# EasyEDA Pro project ProPrj_NavBot-EN01_2025-11-07.epro, board MAIN
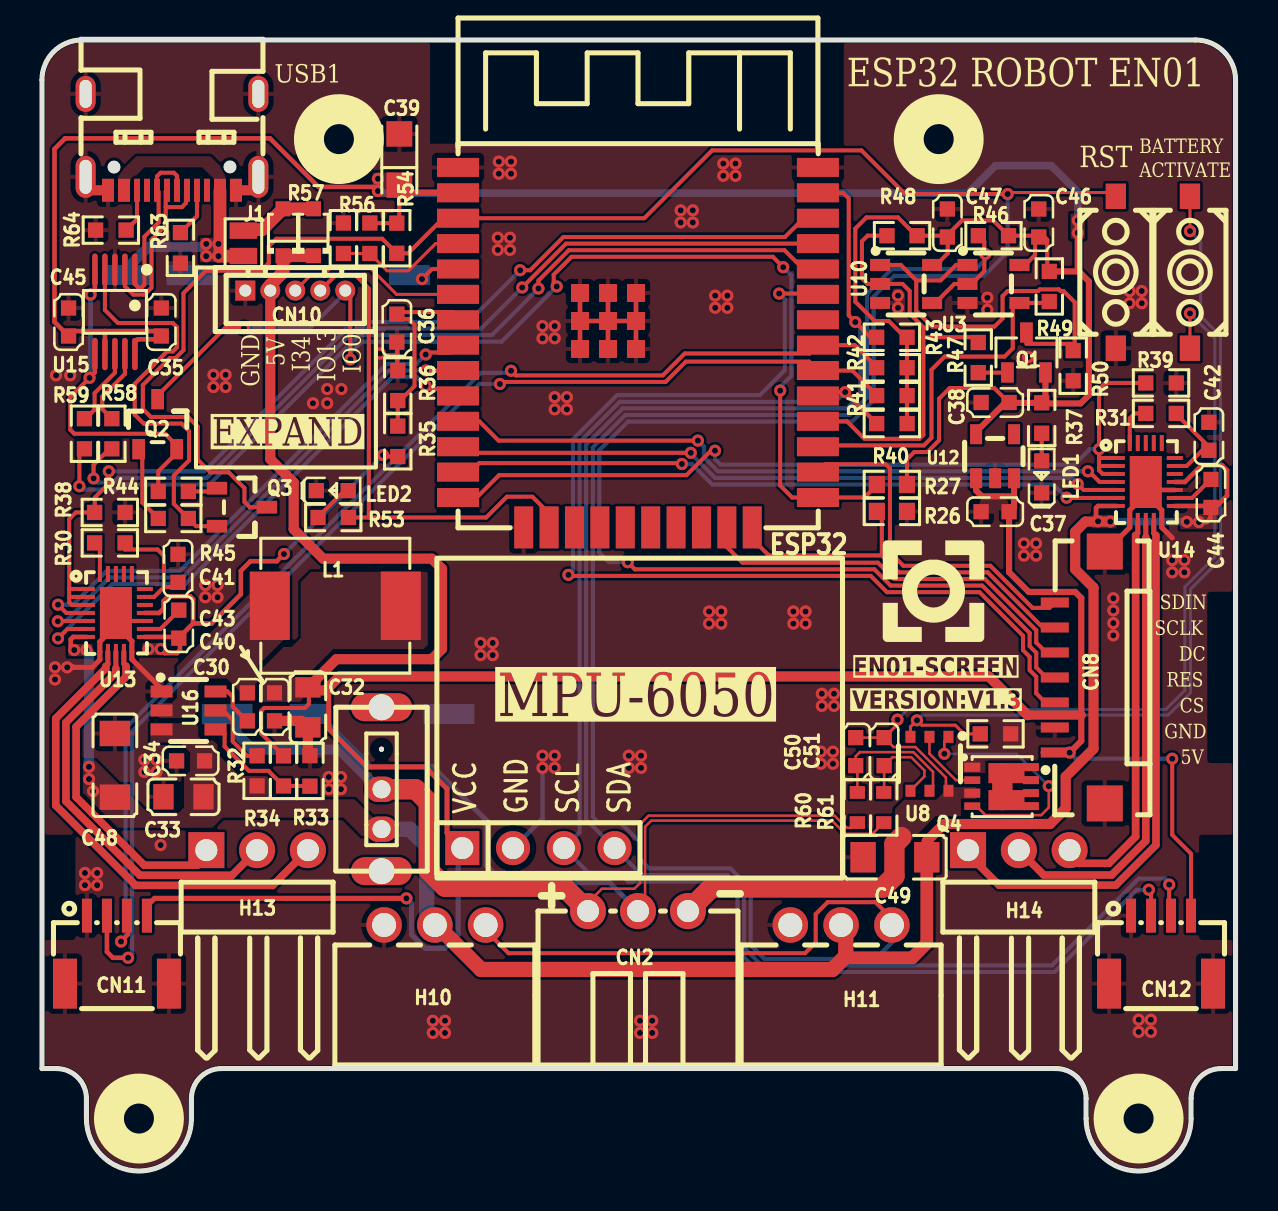
[diagram p14: board, top side]
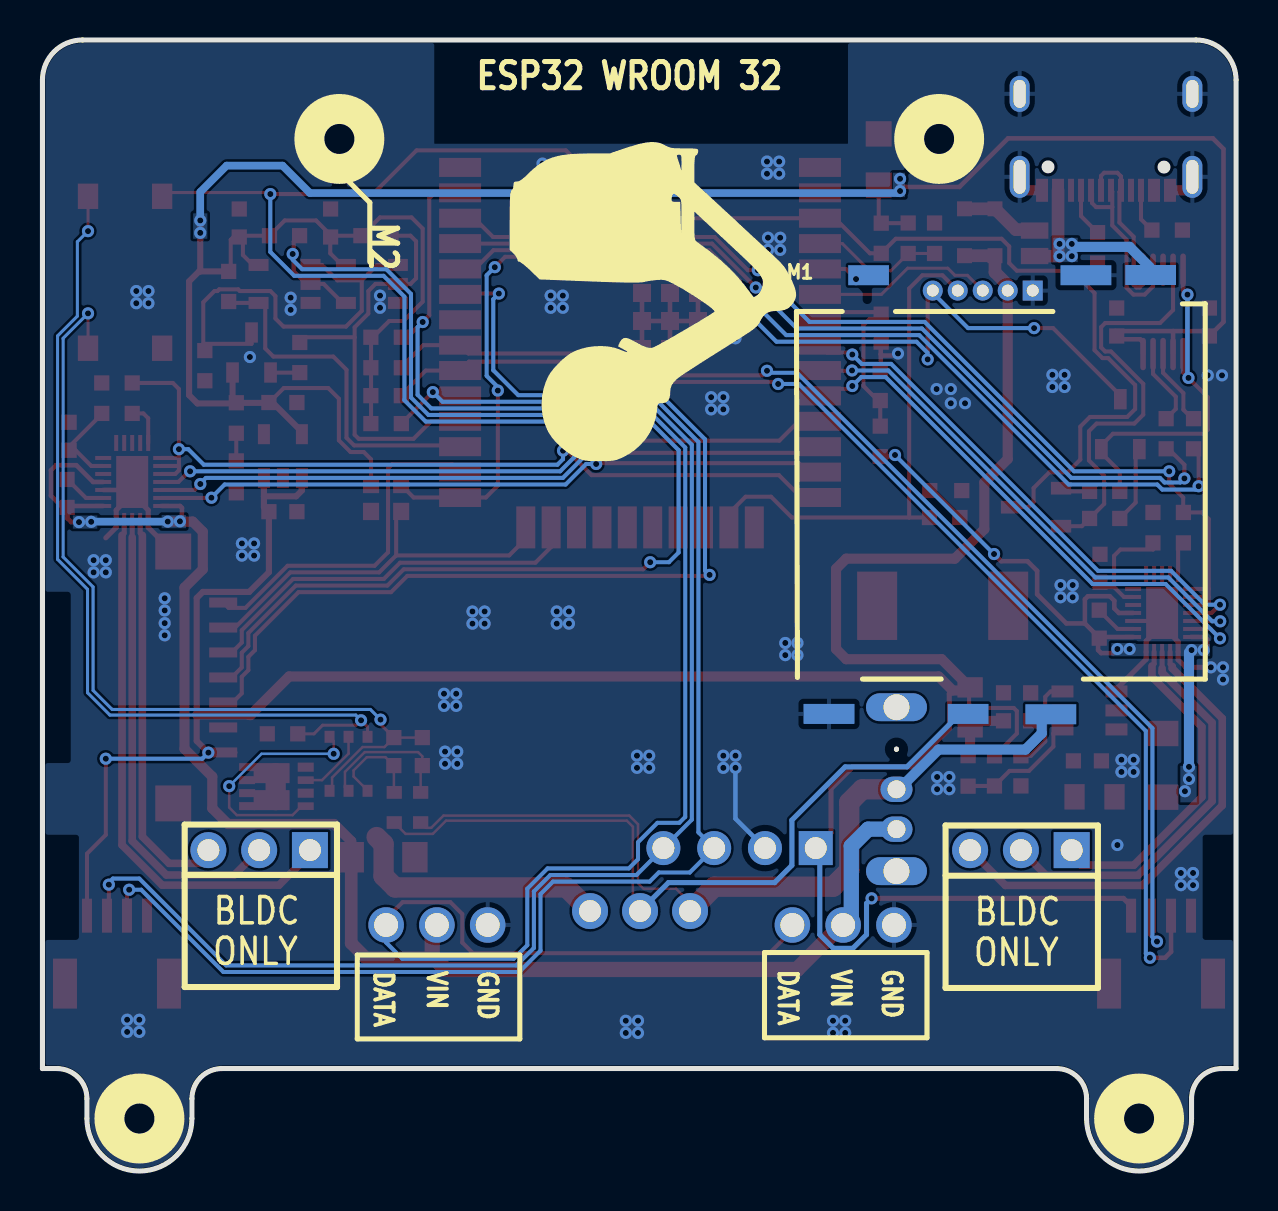
[diagram p15: board, bottom side, seen from below]

Outline 59.7 x 56.57 mm; copper layers: Top Layer, Bottom Layer. Coordinates in mm from the lower left corner of the outline.
Outline path: 0,54.57 0,5.12 0.72,5.12 arc(1.79,4.69) 2.22,3.62 2.22,2.62 arc(4.85,0) 7.47,2.62 7.47,3.62 arc(7.91,4.69) 8.97,5.12 50.72,5.12 arc(51.79,4.69) 52.22,3.62 52.22,2.62 arc(54.85,0) 57.47,2.62 57.47,3.62 arc(57.91,4.69) 58.97,5.12 59.7,5.12 59.7,54.57 arc(59.11,55.99) 57.7,56.57 2,56.57 arc(0.59,55.99) 0,54.57
Stack: Top Layer 0.035mm / Dielectric1 1.51mm FR4 er 4.5 / Bottom Layer 0.035mm

## Design rules (mm)
template: 用户自定义配置
spacing Default (default): track to track 0.127, other pairs 0 to 0.152
track width Default (default): min 0.127, default 0.254, max 25.4
differential pair differentialPair (default): width min 0.127, default 0.254, max 2.54; gap min 0.152, default 0.152
via Default (default): diameter min 0.45, default 0.61, max 100.025; hole min 0.249, default 0.305, max 59.995

## Placement (name value [footprint] x y rotation side)
C30  100nF  [C0603]  10.25 23.22 270 top
C32  22uF  [C0805]  13.3 23.19 90 top
C33  22uF  [C0805]  7.08 18.72 0 top
C34  100nF  [C0603]  7.43 20.5 0 top
C35  1uF  [C0603]  5.99 42.47 90 top
C36  100nF  [C0603]  17.77 42.16 90 top
C37  10uF  [C0603]  47.67 32.96 0 top
C38  10uF  [C0603]  47.67 38.42 0 top
C39  10uF  [CAP-SMD_L3.2-W1.6-RD-C7171]  17.87 50.59 90 top
C40  100nF  [C0603]  11.65 23.22 90 top
C41  4.7uF  [C0603]  6.82 30.15 90 top
C42  4.7uF  [C0603]  58.39 36.75 90 top
C43  1uF  [C0603]  6.82 27.35 270 top
C44  1uF  [C0603]  58.45 33.89 270 top
C45  100nF  [C0603]  1.31 42.47 270 top
C46  100nF  [C0603]  49.88 47.42 90 top
C47  100nF  [C0603]  45.31 47.42 90 top
C48  100uF  [C1206]  3.65 20.29 270 top
C49  100uF  [C1206]  42.66 15.7 0 top
C50  100nF  [C0603]  40.68 20.98 270 top
C51  100nF  [C0603]  42.1 20.98 270 top
CN2  HX25003-3WAP  [CONN-TH_3P-P2.50_HX25003-3WAP]  29.81 13 0 top
CN7  SS-12D02-VG4  [SW-TH_SS-12D02-VG4]  16.98 19.1 90 top
CN8  1.25-7P WT  [CONN-SMD_7P-P1.25-L4.4-W13.5]  51.86 24.69 90 top
CN10  HC-1.25-5A  [CONN-TH_5P-P1.25_HCTL_HC-1.25-5A]  12.67 44.04 0 top
CN11  WAFER-SH1.0-4PWB  [CONN-SMD_4P-P1.00_WAFER-SH1.0-4PWB]  3.75 11.07 0 top
CN12  WAFER-SH1.0-4PWB  [CONN-SMD_4P-P1.00_WAFER-SH1.0-4PWB]  55.97 11.07 0 top
D2  1N5819WS  [SOD-323_L1.8-W1.3-LS2.5-RD]  13.58 46.96 90 top
D3  1N5819WS  [SOD-323_L1.8-W1.3-LS2.5-RD]  12.06 46.96 90 top
H10  5264-3A  [CONN-TH_5264-3AW]  19.65 11.61 0 top
H11  5264-3A  [CONN-TH_5264-3AW]  39.97 11.61 0 top
H13  PZ254R-11-03P  [HDR-TH_3P-P2.54-H-M-W10.4]  10.76 16.05 0 top
H14  PZ254R-11-03P  [HDR-TH_3P-P2.54-H-M-W10.4]  48.86 16.05 0 top
H15  -  [HDR-TH_4P-P2.54-V-M]  24.83 16.15 0 top
J1  -  [0805短接点_FG]  10.07 46.4 90 top
KEY2  K2-3.6×6.1_SMD  [KEY-SMD_2P-L6.2-W3.6-LS8.0]  53.71 44.96 270 top
KEY3  K2-3.6×6.1_SMD  [KEY-SMD_2P-L6.2-W3.6-LS8.0]  57.42 44.96 270 top
L1  10uH  [IND-SMD_L7.3-W6.6]  14.67 28.27 180 top
LED1  KT-0603R  [LED0603-RD]  50 34.72 90 top
LED2  NCD0603B1  [LED0603-RD]  14.52 34.03 0 top
M1  -  [2S充电模块]  11.78 33.83 180 bottom
Q1  SS8550-C148468  [SOT-23-3_L2.9-W1.3-P1.90-LS2.4-BR#2]  49.24 40.94 270 top
Q2  SS8050_C541705  [SOT-23-3_L2.9-W1.3-P1.90-LS2.4-BR]  5.79 37.36 270 top
Q3  SS8050_C541705  [SOT-23-3_L2.9-W1.3-P1.90-LS2.4-BR]  10 33.2 180 top
Q4  WSD3056DN33  [POWERPAK-SO-8_L3.0-W3.0-P0.65-BL]  48 19.23 270 top
R26  4.7K  [R0603]  42.51 32.99 0 top
R27  4.7K  [R0603]  42.51 34.34 0 top
R30  4.7kΩ  [R0603#2]  3.39 31.42 180 top
R31  4.7kΩ  [R0603#2]  55.97 37.89 180 top
R32  10kΩ  [R0603#2]  10.76 20.02 90 top
R33  18kΩ  [R0603#2]  13.4 20.01 270 top
R34  100kΩ  [R0603#2]  12.08 20.01 90 top
R35  3kΩ  [R0603#2]  17.8 36.5 270 top
R36  1kΩ  [R0603#2]  17.8 39.29 270 top
R37  3.3kΩ  [R0603#2]  50 37.67 270 top
R38  4.7kΩ  [R0603#2]  3.39 32.94 0 top
R39  4.7kΩ  [R0603#2]  55.97 39.42 0 top
R40  4.7kΩ  [R0603#2]  42.51 37.39 0 top
R41  4.7kΩ  [R0603#2]  42.51 38.78 0 top
R42  4.7kΩ  [R0603#2]  42.51 40.18 0 top
R43  4.7kΩ  [R0603#2]  42.51 41.7 0 top
R44  10kΩ  [R0603#2]  6.57 33.99 0 top
R45  10kΩ  [R0603#2]  6.57 32.64 180 top
R46  10kΩ  [R0603#2]  47.59 46.78 0 top
R47  10kΩ  [R0603#2]  46.83 40.69 270 top
R48  10kΩ  [R0603#2]  43.02 46.78 0 top
R49  10kΩ  [R0603#2]  50.38 44.24 90 top
R50  10kΩ  [R0603#2]  51.58 40.28 90 top
R53  3.3kΩ  [R0603#2]  14.57 32.69 180 top
R54  10kΩ  [R0603#2]  17.75 46.66 270 top
R56  30kΩ  [R0603#2]  16.4 46.66 90 top
R57  2kΩ  [R0603#2]  15.08 46.66 270 top
R58  1kΩ  [R0603#2]  3.5 36.88 270 top
R59  1kΩ  [R0603#2]  2.12 36.88 270 top
R60  330Ω  [R0603#3]  40.78 18.18 90 top
R61  330Ω  [R0603#3]  42.1 18.18 90 top
R62  2kΩ  [R0603#2]  47.69 21.87 180 top
R63  4.7kΩ  [R0603#2]  6.93 46.18 90 top
R64  4.7kΩ  [R0603#2]  3.45 47.06 0 top
U3  SN74LVC1G125DBVR  [SOT-23-5_L3.0-W1.7-P0.95-LS2.8-BR]  47.59 44.37 180 top
U5  ESP32-WROOM-32E-N8  [WIFI-SMD_ESP32-WROOM-32E]  29.81 41.2 270 top
U8  HY2120-LB  [SOT-23-6_L2.9-W1.6-P0.95-LS2.8-BR]  44.39 20.37 90 top
U10  SN74LVC1G126DBVR  [SOT-23-5_L3.0-W1.7-P0.95-LS2.8-BR]  43.22 44.37 180 top
U12  XC6210B332MR  [SOT-23-5_L2.9-W1.6-P0.95-LS2.8-BR]  47.67 35.75 270 top
U13  SS6343M  [QFN-24_L4.0-W3.0-P0.40-TL-EP]  3.7 27.91 0 top
U14  SS6343M  [QFN-24_L4.0-W3.0-P0.40-TL-EP]  55.21 34.47 0 top
U15  CH340X  [MSOP-10_L3.0-W3.0-P0.50-LS5.0-BL]  3.65 42.97 180 top
U16  TPS563201DDCR  [SOT-23-6_L2.9-W1.6-P0.95-LS2.8-BR#2]  7.33 23.04 180 top
USB1  TYPEC-304-ACP16  [USB-C-SMD_TYPE-C-16P-1]  6.5 51.47 180 top

## Footprints (pads in the part's own frame, mm; a bottom-side part is the same pattern mirrored in y, then rotated)
2S充电模块
  rect 2.54x1 smd: 1(7.505,10.988) 2(4.271,10.978) 4(-8.582,-10.967) 6(2.514,-10.984)
  rect 2.032x1 smd: 3(-6.601,10.978) 5(-1.623,-10.967)
0805短接点_FG
  rect 0.813x1.377 smd: 1(-0.635,0) 2(0.635,0)
C0603
  rect 0.762x0.762 smd: 1(-0.7,0.019) 2(0.7,0.019)
C0805
  rect 1.016x1.27 smd: 1(-1,0) 2(1,0)
C1206
  rect 1.27x1.524 smd: 1(-1.593,0) 2(1.593,0)
CAP-SMD_L3.2-W1.6-RD-C7171
  rect 1.27x1.296 smd: 1(-1.28,0) 2(1.28,0)
CONN-SMD_4P-P1.00_WAFER-SH1.0-4PWB
  rect 0.5x1.7 smd: 1(-1.5,1.7) 2(-0.5,1.7) 3(0.5,1.7) 4(1.5,1.7)
  rect 1.2x2.5 smd: 5(-2.6,-1.7) 6(2.6,-1.7)
CONN-SMD_7P-P1.25-L4.4-W13.5
  rect 1.8x1.8 smd: 0(-6.3,-1.3) 0(6.3,-1.3)
  rect 0.5x1.4 smd: 1(-3.75,1.198) 2(-2.5,1.198) 3(-1.25,1.198) 4(0,1.198) 5(1.25,1.198) 6(2.499,1.198) 7(3.75,1.198)
CONN-TH_3P-P2.50_HX25003-3WAP
  round 1.8 hole 1.1: 1(-2.5,0) 2(0.001,0) 3(2.5,0)
CONN-TH_5P-P1.25_HCTL_HC-1.25-5A
  rect 1x1 hole 0.6: 1(-2.5,0)
  round 1 hole 0.6: 2(-1.25,0) 3(0,0) 4(1.25,0) 5(2.5,0)
CONN-TH_5264-3AW
  round 1.778 hole 1.2: 1(2.54,0.7) 2(0,0.7) 3(-2.54,0.7)
HDR-TH_3P-P2.54-H-M-W10.4
  rect 1.8x1.8 hole 1.1: 1(-2.54,0)
  round 1.8 hole 1.1: 2(0,0) 3(2.54,0)
HDR-TH_4P-P2.54-V-M
  rect 1.7x1.7 hole 1.1: 1(-3.81,0)
  round 1.7 hole 1.1: 2(-1.27,0) 3(1.27,0) 4(3.81,0)
IND-SMD_L7.3-W6.6
  rect 2x3.42 smd: 1(3.278,0) 2(-3.278,0)
KEY-SMD_2P-L6.2-W3.6-LS8.0
  rect 1.27x1.016 smd: 1(-3.8,0) 2(3.8,0)
LED0603-RD
  rect 0.762x0.762 smd: 1(-0.799,0) 2(0.799,0)
MSOP-10_L3.0-W3.0-P0.50-LS5.0-BL
  oval 0.28x1.62 smd: 1(-1,-2.11) 2(-0.5,-2.11) 3(0,-2.11) 4(0.5,-2.11) 5(1,-2.11) 6(1,2.11) 7(0.5,2.11) 8(0,2.11) 9(-0.5,2.11) 10(-1,2.11)
POWERPAK-SO-8_L3.0-W3.0-P0.65-BL
  rect 0.457x0.8 smd: 1(-0.975,-1.466) 3(0.325,-1.466)
  rect 0.381x0.8 smd: 2(-0.325,-1.466) 4(0.975,-1.466)
  rect 0.4x0.8 smd: 5(0.975,1.466) 6(0.325,1.466) 7(-0.325,1.466) 8(-0.975,1.466)
  rect 1x1.8 smd: 9(-0.675,0.241) 10(0.675,0.241)
QFN-24_L4.0-W3.0-P0.40-TL-EP
  rect 0.8x0.2 smd: 1(-1.45,1.2) 2(-1.45,0.8) 3(-1.45,0.4) 4(-1.45,0) 5(-1.45,-0.4) 6(-1.45,-0.8) 7(-1.45,-1.2) 13(1.45,-1.2) 14(1.45,-0.8) 15(1.45,-0.4) 16(1.45,-0.001) 17(1.45,0.4) 18(1.45,0.8) 19(1.45,1.2)
  rect 0.2x0.8 smd: 8(-0.8,-1.95) 9(-0.4,-1.95) 10(0,-1.95) 11(0.4,-1.95) 12(0.8,-1.95) 20(0.8,1.95) 21(0.4,1.95) 22(0,1.95) 23(-0.4,1.95) 24(-0.8,1.95)
  rect 1.6x2.6 smd: 25(0,0)
R0603
  rect 0.806x0.864 smd: 1(-0.753,0) 2(0.753,0)
R0603#2
  rect 0.762x0.762 smd: 1(-0.762,0) 2(0.762,0)
R0603#3
  rect 0.635x0.762 smd: 1(-0.753,0) 2(0.753,0)
SOD-323_L1.8-W1.3-LS2.5-RD
  rect 0.75x0.75 smd: 1(-1.173,0) 2(1.173,0)
SOT-23-3_L2.9-W1.3-P1.90-LS2.4-BR
  rect 1.016x0.635 smd: 1(1.25,-0.95) 2(1.25,0.95) 3(-1.25,0)
SOT-23-3_L2.9-W1.3-P1.90-LS2.4-BR#2
  rect 1.016x0.635 smd: 1(1,-0.95) 2(1,0.95) 3(-1,0)
SOT-23-5_L2.9-W1.6-P0.95-LS2.8-BR
  rect 1x0.6 smd: 1(1.1,-0.95) 2(1.1,0) 3(1.1,0.95) 4(-1.1,0.95) 5(-1.1,-0.95)
SOT-23-5_L3.0-W1.7-P0.95-LS2.8-BR
  rect 1x0.6 smd: 1(1.3,-0.95) 2(1.3,0) 3(1.3,0.95) 4(-1.3,0.95) 5(-1.3,-0.95)
SOT-23-6_L2.9-W1.6-P0.95-LS2.8-BR
  rect 0.6x0.5 smd: 1(1.35,-0.95) 2(1.35,0) 3(1.35,0.95) 4(-1.35,0.95) 5(-1.35,0) 6(-1.35,-0.95)
SOT-23-6_L2.9-W1.6-P0.95-LS2.8-BR#2
  rect 1.1x0.6 smd: 1(1.35,-0.95) 2(1.35,0) 3(1.35,0.95) 4(-1.35,0.95) 5(-1.35,0) 6(-1.35,-0.95)
SW-TH_SS-12D02-VG4
  oval 1.27x1.6 hole 0.9: 1(-2,0) 2(-0.006,0)
  oval 0.254x0.254 hole 0.9: 3(2,0)
  oval 1.397x3.048 hole 1.3: 4(4.1,0) 5(-4.1,0)
USB-C-SMD_TYPE-C-16P-1
  rect 0.6x1.15 smd: A1B12(-3.2,2.41) A4B9(-2.4,2.41) B1A12(3.2,2.41) B4A9(2.4,2.41)
  rect 0.3x1.15 smd: A5(-1.25,2.41) A6(-0.25,2.41) A7(0.25,2.41) A8(1.25,2.41) B5(1.75,2.41) B6(0.75,2.41) B7(-0.75,2.41) B8(-1.75,2.41)
  oval 1x2.1 hole 0.6x1.7: EP(-4.32,1.74) EP(4.32,1.74)
  oval 1x1.8 hole 0.6x1.4: EP(-4.32,-2.41) EP(4.32,-2.41)
WIFI-SMD_ESP32-WROOM-32E
  rect 0.95x2.1 smd: 1(-9.002,-9) 2(-7.732,-9) 3(-6.463,-9) 4(-5.192,-9) 5(-3.922,-9) 6(-2.652,-9) 7(-1.383,-9) 8(-0.113,-9) 9(1.157,-9) 10(2.428,-9) 11(3.697,-9) 12(4.968,-9) 13(6.237,-9) 14(7.508,-9) 25(7.508,9) 26(6.237,9) 27(4.968,9) 28(3.697,9) 29(2.428,9) 30(1.157,9) 31(-0.113,9) 32(-1.383,9) 33(-2.652,9) 34(-3.922,9) 35(-5.192,9) 36(-6.463,9) 37(-7.732,9) 38(-9.002,9)
  rect 2.1x0.95 smd: 15(9.002,-5.715) 16(9.002,-4.445) 17(9.002,-3.175) 18(9.002,-1.905) 19(9.002,-0.635) 20(9.002,0.635) 21(9.002,1.905) 22(9.002,3.175) 23(9.002,4.445) 24(9.002,5.715)
  rect 0.9x0.9 smd: 39(-2.721,-0.1) 39(-2.721,-1.5) 39(-2.721,-2.9) 39(-1.321,-0.1) 39(-1.321,-1.5) 39(-1.321,-2.9) 39(0.079,-0.1) 39(0.079,-1.5) 39(0.079,-2.9)

## Nets
As in the schematic.

Pads without a net: CN7 3 4 5; U5 17 18 19 20 21 22 32; U12 4; U13 17 19 20 21 22 23; U14 17 19 20 21 22 23; USB1 A8 B8

## Via types
v1: diameter 0.61, hole 0.305, Top Layer to Bottom Layer, 191 vias

## Routing (per net, layer and track width the routed paths; a pad name or vN(x,y) marks a point on that pad's centre or on a via; arc(x,y) is an arc through that point)
GND: length 43.8
  Top Layer w0.203: 3.7,27.28 U13.25 4.1,27.51 U13.15
  Top Layer w0.229: U5.39 U5.39 ; U5.39 U5.39 ; U5.39 U5.39 ; U5.39 U5.39 ; U5.39 U5.39 ; U5.39 U5.39 ; U5.39 U5.39 ; U5.39 U5.39 ; U14.15 55.61,34.07 U14.25 ; R36.1 17.77,40.07 17.77,40.85 ; v1(16.91,40.89) 17.01,40.79 17.71,40.79 17.77,40.85 ; 17.77,41.46 17.77,40.85
  Top Layer w0.254: U16.1 5.98,24.11 4.5,25.6 U13.12 4.5,26.5 3.72,27.28 3.7,27.28 3.7,27.28 2.9,26.48 U13.8 2.9,25.58 2.51,25.19 1.57,25.19 1.52,25.25 ; 56.53,31.67 56.01,32.19 U14.12 56.01,33.06 55.24,33.83 55.21,33.83 ; U14.25 55.21,33.86 54.41,33.06 U14.8 54.41,32.19 53.21,30.99 52.7,30.99
  Top Layer w0.508: 11.65,22.52 12.98,22.52 C32.1 13.3,20.87 13.4,20.77 ; USB1.EP 2.18,49.06 USB1.B1A12 ; USB1.A1B12 10.82,49.06 USB1.EP
  Bottom Layer w0.229: 23.88,16.47 25.04,17.63 v1(25.04,20.17)
  vias: v1(0.7,39.8) v1(0.65,25.19) v1(0.65,24.59) v1(1.26,25.19) v1(1.41,39.8) v1(2.15,14.91) v1(2.15,14.3) v1(2.76,14.91) v1(2.76,14.3) v1(5.12,20.57) v1(5.12,19.96) v1(5.73,20.57) v1(5.73,19.96) v1(5.94,16.3) v1(8.17,29.31) v1(8.17,28.7) v1(8.58,39.83) v1(8.58,39.22) v1(8.78,29.31) v1(8.78,28.7) v1(9.19,39.83) v1(9.19,39.22) v1(13.56,38.4) v1(14.27,39.11) v1(14.27,38.4) v1(14.34,19.71) v1(14.34,19.1) v1(14.98,39.11) v1(14.95,19.71) v1(14.95,19.1) v1(19.55,7.52) v1(19.55,6.91) v1(20.16,7.52) v1(20.16,6.91) v1(21.94,26.41) v1(21.94,25.8) v1(22.55,26.41) v1(22.55,25.8) v1(22.8,46.68) v1(22.8,46.07) v1(22.85,50.49) v1(22.85,49.88) v1(23.41,46.68) v1(23.41,46.07) v1(23.46,50.49) v1(23.46,49.88) v1(25.04,42.26) v1(25.04,41.65) v1(25.04,20.78) v1(25.65,42.26) v1(25.65,41.65) v1(25.65,38.71) v1(25.65,38.1) v1(25.65,20.78) v1(25.65,20.17) v1(26.25,38.71) v1(26.25,38.1) v1(29.35,20.78) v1(29.35,20.17) v1(29.91,7.52) v1(29.91,6.91) v1(29.96,20.78) v1(29.96,20.17) v1(30.52,7.52) v1(30.52,6.91) v1(31.94,48.05) v1(31.94,47.45) v1(32.55,48.05) v1(32.55,47.45) v1(33.37,27.99) v1(33.37,27.38) v1(33.67,43.79) v1(33.67,43.18) v1(33.98,27.99) v1(33.98,27.38) v1(34.08,50.39) v1(34.08,49.78) v1(34.28,43.79) v1(34.28,43.18) v1(34.69,50.39) v1(34.69,49.78) v1(37.58,27.99) v1(37.58,27.38) v1(38.19,27.99) v1(38.19,27.38) v1(39.01,23.87) v1(39.01,23.26) v1(38.95,20.98) v1(38.95,20.37) v1(39.62,23.87) v1(39.62,23.26) v1(39.56,20.98) v1(39.56,20.37) v1(42.82,43.79) v1(42.82,43.18) v1(47.29,43.69) v1(47.29,43.08) v1(49.12,31.39) v1(49.12,30.78) v1(49.32,40.72) v1(49.72,31.39) v1(49.72,30.78) v1(53.59,28.65) v1(53.59,28.04) v1(53.59,27.41) v1(53.59,26.8) v1(54.4,44.02) v1(54.4,43.41) v1(54.86,7.57) v1(54.86,6.96) v1(55.01,44.02) v1(55.01,43.41) v1(55.47,7.57) v1(55.47,6.96) v1(56.53,30.55) v1(56.53,29.94) v1(57.14,30.55) v1(57.14,29.94)
VBUS: length 9
  Top Layer w0.635: 10.07,45.82 10.02,45.76 v1(8.83,45.76) 8.9,45.84 USB1.A4B9
  Bottom Layer w0.508: 4.32,45.22 5.33,46.23 8.07,46.23 v1(8.22,46.37)
  vias: v1(8.22,45.76) v1(8.83,46.37)
VCC-3.3V: length 135.5
  Top Layer w0.203: 45.31,46.72 45.31,45.9 44.72,45.32 U10.5 ; 45.31,46.72 45.24,46.78 R48.2 43.73,46.78 42.82,47.7 41.24,47.7 40.68,47.14 40.68,43.48 41.65,42.52 42.36,42.52 43.17,41.7 43.26,41.7 43.26,37.39 ; 45.31,46.72 45.31,46.84 46.02,47.55 47.58,47.55 R46.2 49.81,46.78 49.88,46.72 ; U3.5 49.18,45.32 49.67,45.82 49.67,46.52 49.88,46.72 ; R49.2 50.28,45.1 50.28,46.58 50.15,46.72 49.88,46.72 ; 16.22,47.41 R54.1 17.87,47.54 C39.1 ; R27.2 43.26,35.6 43.63,35.96 44.29,35.96 44.87,36.55 44.87,38.63 45.41,39.16 47.63,39.16 48.37,38.42
  Top Layer w0.229: 3.14,42.01 3.15,42 U15.7 ; 3.14,42.01 6.06,42.01 6.06,41.77 5.9,41.6 4.8,41.6 4.65,41.46 U15.10 ; 3.14,42.01 1.33,42.01 C45.2 0.63,42.47 0.63,51.12 1.16,51.65 11.41,51.65 13.83,49.22 16.59,49.22 16.76,49.05
  Top Layer w0.305: U12.5 46.72,36.98 48.17,38.42 49.98,38.42 50,38.39 ; R49.2 51.81,45 ; 51.81,45 51.87,45 52.37,44.5 52.37,38.81 51.95,38.39 50,38.39 ; 51.81,45 v1(51.81,46.93) v1(51.81,47.55) ; Q1.2 50.19,38.58 50,38.39 ; U5.2 18.26,48.93 C39.1
  Bottom Layer w0.381: v1(51.81,47.55) 51.81,48.97 50.49,50.29 47.69,50.29 46.32,48.92 16.91,48.92 v1(16.81,49.02)
  vias: v1(16.81,49.63)
VCC-5V: length 151.1
  Top Layer w0.203: v1(56.53,20.62) 56.53,16.81 57.47,15.87 CN12.4 ; 13.35,24.14 13.35,23.37 13.15,23.16 11.12,23.16 10.96,23.01 10.96,21.88 R34.2
  Top Layer w0.254: v1(18.23,13.64) 5.63,13.64 5.25,13.26 CN11.4 ; 14.17,24.04 14.34,23.87 14.34,22.12 16.25,20.22 19.17,20.22 20.26,19.12 20.26,16.91 H15.1
  Top Layer w0.305: U12.3 48.62,33.75 ; 48.62,33.75 47.01,33.75 46.72,34.04 U12.1 ; 48.62,33.75 48.62,33.21 48.37,32.96 48.37,29.95 49.36,28.97 51.68,28.97 51.98,28.66 51.98,21.51 v1(51.4,20.93) 50.11,20.93 50.1,20.94
  Top Layer w0.457: 49.34,22.81 51.98,22.81
  Top Layer w0.508: 49.34,22.81 49.29,22.81 47.36,24.74 14.88,24.74 14.17,24.04 13.46,24.04 13.35,24.14 ; C32.2 13.31,24.19 14.72,25.6 19.5,25.6 20.01,26.11 20.01,30.12 19.5,30.63 14.06,30.63 12.59,32.1 12.59,34.44 11.42,35.61 CN10.2
  Top Layer w0.635: D2.1 D3.1 12.06,44.96 11.42,44.32 11.42,44.04
  Bottom Layer w0.203: v1(56.53,20.62) 51.71,20.62 v1(51.4,20.93)
  Bottom Layer w0.254: v1(18.23,13.64) 18.48,13.38 18.48,11.82 19.17,11.14 20.13,11.14 20.82,11.82 20.82,15.95 H15.1
VIN: length 109.2
  Top Layer w0.229: 7.56,27.39 8.49,27.39 9.95,28.85 9.95,30.02 10.43,30.5 11.75,30.5 v1(12.1,30.86) ; 7.56,27.39 6.82,26.65 ; 7.56,27.39 7.56,28.6 7.41,28.75 6.32,28.75 6.09,28.52 6.09,28.14 5.86,27.91 U13.16 ; v1(1.62,26.06) 1.44,26.24 1.44,26.59 1.56,26.71 U13.7 ; 6.82,26.65 6.9,26.58 6.9,26.06 6.75,25.91 6.14,25.91 v1(5.94,26.11) ; 6.82,26.65 6.76,26.71 U13.13 ; 17.8,35.74 17.13,35.74 v1(17.06,35.81) ; 58.45,33.19 58.69,33.19 59.28,33.78 59.28,35.05 59.02,35.3 58,35.3 57.17,34.47 U14.16 ; 58.45,33.19 58.38,33.27 U14.13 ; 58.45,33.19 58.45,32.65 58.26,32.46 v1(57.87,32.46) 57.86,32.47 v1(57.26,32.47) ; U14.7 52.82,33.27 52.72,33.17 52.72,32.6 v1(52.82,32.5)
  Top Layer w0.508: C49.2 44.26,16.5 45.11,17.36 50.42,17.36 51.2,18.14 51.2,19.73 52.59,21.12 52.59,29.18 51.68,30.1 51.68,31.98 52.19,32.48 v1(53.43,32.48)
  Top Layer w0.635: 40.21,10.67 43.53,10.67 44.26,11.39 C49.2
  Top Layer w0.762: H11.2 40.21,12.07 40.21,10.75 39.54,10.08 21.96,10.08 19.89,12.15 19.8,12.15 H10.2
  Bottom Layer w0.203: v1(17.06,35.81) 17.06,35.81 12.11,30.86 v1(12.1,30.86)
  Bottom Layer w0.381: 57.29,32.46 57.27,32.48 v1(53.43,32.48)
  Bottom Layer w0.508: v1(2.35,20.22) 2.35,25.93 v1(2.23,26.06)
  Bottom Layer w0.762: H10.2 19.24,12.71 19.24,16.25 18.4,17.1 CN7.1
  vias: v1(2.35,19.61) v1(2.56,19) v1(5.33,26.11)
B1: length 38.3
  Top Layer w0.127: R61.1 41.54,16.86 40.17,16.86 39.51,17.52 30.47,17.52 30.17,17.22 30.17,13.36 CN2.2
  Bottom Layer w0.254: 13.86,22.86 13.86,22.82 16.46,20.22 19.55,20.22 22.22,17.55 22.22,15.29 23.08,14.43 28.39,14.43 CN2.2
B2: length 42
  Top Layer w0.127: CN2.1 27.31,13.42 28.01,14.12 29.63,14.12 29.91,14.4 29.91,17.35 30.34,17.78 39.64,17.78 40.25,17.17 40.52,17.17 R60.1
  Top Layer w1.016: CN2.1 26.09,14.22 20.16,14.22 19.35,15.03 19.35,18.44 18.69,19.09 CN7.2
  Bottom Layer w0.508: CN7.2 16.86,19.09 14.88,21.08 10.53,21.08 9.72,21.89 9.72,22.85
B-: length 57.1
  Top Layer w0.127: C50.1 C51.1 42.59,21.21 43.69,21.21 45.21,19.68 45.21,19.15 U8.6
  Top Layer w0.152: v1(42.79,22.58) 42.79,22.35 C51.1 ; 57.42,41.16 v1(57.42,42.9)
  Top Layer w1.016: CN2.3 33.49,14.19 42.07,14.19 42.64,14.76 42.64,16.36 42.99,16.7
  Bottom Layer w0.152: v1(57.42,42.9) 58.67,41.65 58.67,30.71 57.17,29.22 57.17,24.04 56.21,23.09 43.3,23.09 v1(42.79,22.58)
BAT_ADC: length 10
  Top Layer w0.203: 17.8,37.25 R36.2 17.91,38.54 18.63,39.27 18.63,42.31 18.33,42.62 17.77,42.62 17.77,42.86 17.87,42.96 20.53,42.96 20.81,42.68 U5.7
BOOT0: length 56.8
  Top Layer w0.203: v1(15.42,40.6) 15.42,43.79 CN10.5 ; v1(36.92,39.04) 36.92,34.29 37.52,33.69 U5.25 41.14,33.69 41.76,34.31 R27.1 ; v1(10.1,42.16) 9.15,42.16 5.79,38.8 Q2.3 ; v1(25.75,44.24) 25.59,44.4 25.59,44.83 26.49,45.73 36.56,45.73 v1(37.08,45.21)
  Bottom Layer w0.203: v1(25.75,44.24) 22.98,41.48 15.98,41.48 15.43,40.93 15.43,40.61 v1(15.42,40.6) ; CN10.5 15.17,43.93 13.4,42.16 v1(10.1,42.16) ; v1(37.08,45.21) 37.48,44.8 37.48,39.77 36.92,39.22 v1(36.92,39.04)
CS: length 44.7
  Top Layer w0.152: v1(57.42,47.01) KEY3.1 ; U8.3 43.44,22.22 v1(43.76,22.54) 44.01,22.3 45.69,22.3 46.12,21.87 R62.2
  Bottom Layer w0.152: v1(43.76,22.54) 44.03,22.81 56.33,22.81 57.45,23.92 57.45,29.1 58.94,30.6 58.94,41.77 57.95,42.76 57.95,46.48 v1(57.42,47.01)
D+: length 8.9
  Top Layer w0.203: USB1.A6 6.75,49.78 6.6,49.93 5.94,49.93 5.75,49.75 USB1.B6 5.83,48.98 5.83,47.45 5.12,46.73 5.12,44.33 4.98,44.19 4.82,44.19 4.65,44.36 U15.1
D-: length 9.4
  Top Layer w0.203: U15.2 4.15,44.26 4.57,43.84 5.13,43.84 5.48,44.19 5.48,46.59 6.19,47.3 6.19,48.21 ; 6.19,48.21 7,48.21 7.2,48.42 7.2,48.9 7.25,48.95 USB1.B7 ; 6.19,48.21 6.19,48.99 USB1.A7
DATA: length 95.4
  Top Layer w0.203: H11.1 42.51,12.62 41.68,13.45 39.3,13.45 38.7,12.85 38.7,11.43 38.17,10.89 23.33,10.89 22.19,12.04 H10.1 ; R46.1 47.13,46.49 47.13,45.01 46.5,44.37 U3.2 45.63,44.37 44.69,43.42 U10.4
  Bottom Layer w0.203: v1(47.18,45.87) 47.18,45.58 46.71,45.11 42.5,45.11 41.27,43.87 41.27,38.69 40.39,37.82 29.18,37.82 27.55,36.19 27.55,17.71 27.85,17.41 28.94,17.41 29.91,16.44 29.91,15.59 30.37,15.14 34.43,15.14 35.45,14.12 35.45,11.3 36.13,10.62 41.7,10.62 42.51,11.43 H11.1
DTR: length 18.2
  Top Layer w0.203: U15.6 2.65,39.94 v1(2.38,39.67) 1.41,38.71 1.41,37.08 1.62,36.88 6.16,36.88 6.74,36.3 6.74,35.92 5.82,35 R44.1
  Top Layer w0.229: v1(2.43,43.84) 2.65,44.06 U15.5
  Bottom Layer w0.229: v1(2.43,43.84) 2.43,39.72 v1(2.38,39.67)
EN: length 129.9
  Top Layer w0.152: KEY2.1 53.52,48.94 48.38,48.94 v1(48.3,48.87)
  Top Layer w0.203: CN8.4 50.23,24.69 49.73,25.19 49.73,25.92 49.4,26.25 49.4,26.91 47.03,29.28 42.45,29.28 41.63,30.1 29.66,30.1 v1(29.3,30.45) ; v1(48.3,48.87) 43.17,48.87 40.99,51.05 33.52,51.05 30.13,47.66 U5.3 20.07,47.66 18.31,45.9 R54.2 17.02,46.63 11.73,46.63 11.34,46.25 11.34,45.41 10.96,45.03 8.2,45.03 7.08,43.91 7.08,41.06 6.68,40.66 6.39,40.66 5.05,39.32 5.05,38.11 5.44,37.72 7.31,37.72 7.79,37.23 7.79,35.58 8.42,34.95 9.34,34.95 10.13,34.16 10.13,33.48 10.4,33.2 Q3.3
  Bottom Layer w0.203: v1(29.3,30.45) 28.36,30.45 27.88,30.94 27.88,36.06 29.31,37.49 40.53,37.49 41.6,38.56 41.6,43.74 42.64,44.78 47.11,44.78 48.3,45.97 v1(48.3,48.87)
IN34: length 9.1
  Top Layer w0.152: CN10.3 13.43,44.8 14.06,44.8 14.42,45.16 16.42,45.16 17.73,43.85 U5.6
IO13: length 26
  Top Layer w0.203: U5.16 25.37,32.89 24.53,33.73 23.26,33.73 22.22,32.69 16.35,32.69 ; 15.32,32.69 16.35,32.69 ; 16.35,32.69 16.35,44.14 15.69,44.8 14.68,44.8 CN10.4
IO15: length 19.9
  Top Layer w0.203: U5.23 34.26,31.21 35.04,30.43 41.81,30.43 42.63,29.61 47.16,29.61 49.73,27.05 49.73,26.43 50.23,25.94 CN8.5
M0_EN: length 51.4
  Top Layer w0.203: 1.36,29.12 1.36,28.72 ; 1.36,29.12 1.36,32.61 1.69,32.94 2.64,32.94 2.64,33.69 3.34,34.39 v1(3.34,35) ; 1.36,29.12 1.37,29.11 2.25,29.11 ; 1.36,28.72 1.37,28.71 U13.2 ; 1.36,28.72 1.36,28.45 1.5,28.31 U13.3 ; v1(23.92,45.06) 24.42,45.06 26.08,46.72 37.16,46.72 38.1,47.66 U5.36
  Bottom Layer w0.203: v1(3.34,35) 8.1,35 15.57,42.47 21.33,42.47 v1(23.92,45.06)
M0_IN1: length 27
  Top Layer w0.203: v1(0.8,28.33) 1.22,27.91 U13.4 ; v1(19.19,40.84) 19.3,40.94 20.44,40.94 U5.8
  Bottom Layer w0.203: v1(19.19,40.84) 18.73,40.37 17.25,40.37 6.9,30.02 3.25,30.02 1.55,28.33 v1(0.8,28.33)
M0_IN2: length 26.7
  Top Layer w0.203: U13.5 0.81,27.51 v1(0.79,27.5) ; v1(19.21,40.04) 19.22,40.03 20.8,40.03 U5.9
  Bottom Layer w0.203: v1(0.79,27.5) 1.19,27.5 3.38,29.69 7.04,29.69 17.39,40.04 v1(19.21,40.04)
M0_IN3: length 28.2
  Top Layer w0.203: v1(0.8,26.64) 1.27,27.11 2.25,27.11 ; U5.10 21.17,39.12 19.34,39.12 v1(19.19,39.27)
  Bottom Layer w0.203: v1(19.19,39.27) 18.75,39.71 17.53,39.71 7.17,29.36 3.52,29.36 v1(0.8,26.64)
M0_OUT1: length 23.8
  Top Layer w0.254: 3.19,25.24 3.3,25.35 U13.9
  Top Layer w0.381: H13.3 11.54,14.29 4.69,14.29 0.69,18.28 0.69,22.64 3.19,25.14 3.19,25.24
M0_OUT2: length 20.1
  Top Layer w0.254: U13.10 3.7,25.14
  Top Layer w0.381: 3.7,25.14 3.7,24.93 1.2,22.43 1.2,18.49 4.9,14.79 9.5,14.79 H13.2
M0_OUT3: length 16.8
  Top Layer w0.254: U13.11 4.1,25.37 4.21,25.26
  Top Layer w0.381: H13.1 8.22,15.75 7.78,15.3 5.11,15.3 1.71,18.71 1.71,22.22 4.21,24.72 4.21,25.26
M1_EN: length 43.2
  Top Layer w0.203: 52.87,35.67 52.87,35.05 53.06,34.87 U14.3 ; 52.87,35.67 v1(52.87,36.11) 52.87,39.11 53.18,39.42 55.22,39.42 ; 52.88,35.67 U14.1 ; v1(33.66,36.03) 33.46,36.03 32.24,34.81 22.86,34.81 21.74,33.69 U5.14 ; U14.2 52.88,35.27
  Bottom Layer w0.203: v1(33.66,36.03) 33.66,35.61 33.94,35.33 51.63,35.33 52.41,36.11 v1(52.87,36.11)
M1_IN1: length 34.5
  Top Layer w0.203: v1(32.81,36.53) 22.84,36.53 21.88,37.5 U5.11 ; v1(52.32,35) 52.37,35 52.9,34.47 U14.4
  Bottom Layer w0.203: v1(52.32,35) 33.81,35 33.1,35.7 33.1,36.24 v1(32.81,36.53)
M1_IN2: length 33.9
  Top Layer w0.203: U5.12 21.37,36.23 21.67,35.92 v1(32.45,35.92) ; v1(51.8,34.36) 52.1,34.07 U14.5
  Bottom Layer w0.203: v1(51.8,34.36) 51.8,34.39 51.53,34.67 33.67,34.67 32.45,35.89 v1(32.45,35.92)
M1_IN3: length 33.9
  Top Layer w0.203: v1(51.25,33.68) 51.26,33.67 U14.6 ; v1(32.01,35.37) 31.97,35.41 21.87,35.41 21.37,34.91 20.86,34.91 U5.13
  Bottom Layer w0.203: v1(51.25,33.68) 50.59,34.34 33.53,34.34 32.5,35.37 v1(32.01,35.37)
M1_OUT1: length 20.1
  Top Layer w0.254: 54.7,31.8 54.81,31.91 U14.9
  Top Layer w0.381: H14.3 51.4,15.86 51.88,15.39 53.37,15.39 54.7,16.73 54.7,31.8
M1_OUT2: length 23.6
  Top Layer w0.254: U14.10 55.21,31.7
  Top Layer w0.381: 55.21,31.7 55.21,16.52 53.5,14.81 50.1,14.81 H14.2
M1_OUT3: length 27.3
  Top Layer w0.254: 55.72,31.8 55.61,31.91 U14.11
  Top Layer w0.381: H14.1 46.32,15.85 47.87,14.3 53.71,14.3 55.72,16.3 55.72,31.8
OLED_CS: length 53.1
  Top Layer w0.203: U5.33 38.77,43.89 v1(36.87,43.89) ; v1(26.33,29.82) 26.38,29.77 41.45,29.77 42.27,28.95 46.89,28.95 49.07,26.77 49.07,26.05 49.4,25.72 49.4,25.05 49.73,24.72 49.73,23.89 50.19,23.44 CN8.3
  Bottom Layer w0.203: v1(26.33,29.82) 26.36,29.82 26.56,30.02 26.56,36.6 28.77,38.81 35.91,38.81 37.15,40.06 37.15,43.61 v1(36.87,43.89)
OLED_SCLK: length 19.8
  Top Layer w0.203: 42.01,30.79 42.86,29.94 47.3,29.94 50.06,27.19 CN8.6 ; 42.01,30.79 42.01,32.69 41.76,32.94 ; 42.01,30.79 36.35,30.79 35.53,31.62 U5.24
OLED_SDI: length 17.6
  Top Layer w0.203: U5.26 39.21,35.35 42.21,35.35 42.41,35.15 42.41,30.95 43.09,30.27 47.44,30.27 49.55,28.17 50.39,28.17 CN8.7
RTS: length 21
  Top Layer w0.203: Q3.2 7.71,32.25 R45.1 6.6,33.37 6.6,34.78 7.36,35.54 7.36,37.01 6.98,37.39 5.09,37.39 4.64,37.83 4.64,39.38 6.26,40.99 6.54,40.99 6.75,41.2 6.75,42.21 6.54,42.42 3.8,42.42 3.15,43.07 U15.4
RXD0: length 44.5
  Top Layer w0.203: v1(24.83,44.14) 24.83,44.54 26.35,46.06 37.14,46.06 38.08,45.12 U5.34 ; 2.14,36.08 1.87,35.81 v1(1.87,34.25)
  Bottom Layer w0.203: v1(1.87,34.25) 2.04,34.08 3.69,34.08 3.94,34.34 8.37,34.34 15.85,41.81 22.5,41.81 v1(24.83,44.14)
SCL_0: length 60
  Top Layer w0.203: v1(22.9,39.37) 23,39.47 31.19,39.47 32.21,40.49 38.37,40.49 U5.30 40.53,40.04 41.76,38.81 41.76,38.78
  Top Layer w0.229: CN11.2 3.25,10.96 3.55,10.67 v1(4.31,10.67)
  Bottom Layer w0.203: v1(4.31,10.67) 4.51,10.87 4.51,22.01 21.87,39.37 v1(22.9,39.37)
SCL_1: length 74.3
  Top Layer w0.203: v1(55.36,14.07) 55.47,13.96 CN12.2 ; 41.76,37.39 41.76,37.43 41.71,37.43 v1(40.17,38.96) 39,38.96 U5.29
  Bottom Layer w0.203: 26.42,15.83 27.32,14.93 28.87,14.93 29.33,14.48 34.16,14.48 34.79,13.85 34.79,11.02 35.86,9.95 50.65,9.95 54.76,14.07 v1(55.36,14.07) ; 26.42,16.47 26.89,16.94 26.89,36.47 28.9,38.48 39.69,38.48 v1(40.17,38.96)
SDA_0: length 58.4
  Top Layer w0.203: 41.76,40.18 41.76,40.21 40.66,41.31 U5.31 38.39,40.89 32.15,40.89 31.06,39.8 23.69,39.8 v1(23.46,40.03) ; v1(3.95,11.48) 4.3,11.83 4.3,12.77
  Bottom Layer w0.203: v1(3.95,11.48) 4.18,11.71 4.18,22.15 21.96,39.93 23.36,39.93 v1(23.46,40.03)
SDA_1: length 83.1
  Top Layer w0.203: 41.76,41.7 41.44,41.7 v1(40.68,42.47) 40.35,42.8 40.35,48.65 40.07,48.93 U5.37 ; CN12.3 56.38,12.87 v1(56.38,14.32)
  Bottom Layer w0.203: v1(56.38,14.32) 56.38,14.43 56.18,14.63 54.86,14.63 50.51,10.28 35.99,10.28 35.12,11.16 35.12,13.98 34.3,14.81 29.99,14.81 28.96,15.83 ; v1(40.68,42.47) 40.94,42.21 40.94,38.83 40.26,38.15 29.04,38.15 27.22,36.33 27.22,17.57 28.32,16.47
SERVO_RX: length 17.8
  Top Layer w0.203: R49.1 50.32,43.42 U3.4 48.76,43.42 48.56,43.22 48.56,41.15 48.15,40.74 45.15,40.74 44.49,40.08 44.49,36.68 44.11,36.3 38.88,36.3 U5.27
SERVO_TX: length 21.7
  Top Layer w0.203: R48.1 41.29,46.78 41.01,46.51 41.01,44.65 41.29,44.37 41.72,44.37 ; U5.28 40.26,37.5 41.14,36.62 43.88,36.62 44.09,36.83 44.09,41.7 ; 44.09,41.7 44.09,42.2 43.4,42.89 43.4,44.02 43.04,44.37 U10.2 ; 44.09,41.7 46.57,41.7 R47.1
TXD0: length 43.2
  Top Layer w0.203: v1(2.58,34.64) 2.58,35.33 3.34,36.08 3.54,36.08 ; v1(24.02,44.19) 26.22,46.39 U5.35
  Bottom Layer w0.203: v1(2.58,34.64) 2.79,34.44 3.58,34.44 3.8,34.67 8.24,34.67 15.71,42.14 21.97,42.14 v1(24.02,44.19)
TXEN: length 21.5
  Top Layer w0.203: Q1.3 49.24,41.38 51.66,41.38 51.66,43.46 51.1,44.02 50.95,44.02 50.86,44.1 49.91,44.1 49.82,44.02 48.3,44.02 48.05,43.76 48.05,42.64 47.64,42.24 44.52,42.24 43.73,43.03 43.73,44.55 ; U3.1 45.72,45.32 44.95,44.55 43.73,44.55 ; 43.73,44.55 42.96,45.32 U10.1
VISION_ADC: length 6.7
  Top Layer w0.152: U5.4 19.69,46.39 18.33,45.03 17.26,45.03 R56.1 R57.2
VSTA: length 2
  Top Layer w0.203: U5.5 19.51,45.12 v1(19.01,44.61)
$1N6461: length 1.4
  Top Layer w0.203: 50,36.89 LED1.2
$1N6486: length 1.5
  Top Layer w0.203: R47.2 48.28,39.94 Q1.1
$1N6507: length 2.1
  Top Layer w0.203: 13.82,32.69 13.82,32.72 15.13,34.03 LED2.2
$1N16875: length 2.1
  Top Layer w0.203: U13.14 5.92,27.11 6.82,28.01 6.82,28.05
$1N17094: length 6
  Top Layer w0.203: 6.82,29.45 6.58,29.21 6.1,29.21 ; 6.1,29.21 6.1,30.77 5.78,31.09 4.15,31.09 4.15,31.42 ; 6.1,29.21 5.61,28.71 5.15,28.71
$1N17219: length 1.7
  Top Layer w0.203: 2.9,29.86 2.9,31.16 2.64,31.42
$1N17548: length 2.2
  Top Layer w0.203: 58.45,34.59 57.52,33.67 U14.14
$1N17578: length 4.6
  Top Layer w0.203: 56.73,37.89 56.73,37.87 58.39,36.21 58.39,36.05 58.04,36.05 57.26,35.27 U14.18
$1N17586: length 2.1
  Top Layer w0.203: 55.22,37.89 54.65,37.89 54.41,37.65 U14.24
$1N17803: length 4
  Top Layer w0.203: 3.54,37.59 3.01,38.11 3.01,38.73 4.15,39.87 U15.9
$1N17807: length 3.9
  Top Layer w0.203: 2.14,37.59 2.63,38.08 2.63,38.91 3.65,39.93 U15.8
$1N18314: length 2.5
  Top Layer w0.203: U16.6 9.28,23.99 9.54,23.72 9.54,23.23 10.25,22.52
$1N18404: length 3.6
  Top Layer w0.203: R32.2 10.26,20.77 9.54,21.49 9.54,22.55 9.06,23.04 U16.5
$1N18959: length 6.3
  Top Layer w0.203: 13.4,19.26 R34.1 11.33,20.01 10.35,20.01 9.14,21.23 9.14,21.88 8.93,22.09 U16.4
$1N21795: length 1.5
  Top Layer w0.203: Q3.1 8.59,33.99 R44.2
$1N21834: length 3.9
  Top Layer w0.203: 4.84,36.11 5.02,35.92 5.02,33.44 R45.2
$1N51806: length 3.9
  Top Layer w0.635: D2.2 D3.2 11.02,47.09 10.07,47.09
$1N52202: length 7.2
  Top Layer w0.127: U8.5 44.57,19.2 44.57,19.97 43.58,20.95 40.91,20.95 40.7,20.74 C50.2 40.78,20.2 R60.2
$1N52203: length 5.1
  Top Layer w0.127: U8.4 43.44,19.04 44.14,19.73 44.14,20.04 43.48,20.7 42.54,20.7 C51.2 42.12,18.96 R61.2
$1N52206: length 1.3
  Top Layer w1.016: 48.04,19.9 48.04,18.55
$1N55084: length 12.1
  Top Layer w0.127: U8.1 45.13,21.51 v1(45.13,20.87) ; v1(50.36,19.25) 50.36,18.18 49.98,17.8 47.19,17.8 46.74,18.25 Q4.4
  Bottom Layer w0.127: v1(50.36,19.25) 48.74,20.87 v1(45.13,20.87)
$1N55091: length 3.4
  Top Layer w0.127: 46.43,19.55 45.72,19.55 44.39,20.88 U8.2
$1N62719: length 2.5
  Top Layer w0.203: USB1.A5 7.75,47.77 R63.2
$1N62774: length 2.2
  Top Layer w0.203: USB1.B5 4.75,47.61 R64.2

## Copper pours and planes (outline as drawn; the poured copper is in the pictures)
GND on Top Layer: 45.48,23.2 49.27,23.2 49.27,19.91 45.48,19.91
GND on Top Layer: -0.67,57.2 61,57.2 61,-1.17 -0.67,-1.17
GND on Bottom Layer: 22.8,16.91 24.32,16.91 24.32,15.39 22.8,15.39
GND on Bottom Layer: -0.77,57.05 62.22,57.05 62.22,-2.14 -0.77,-2.14
VBUS on Top Layer: 7.91,46.68 9.13,46.68 9.13,45.46 7.91,45.46
VBUS on Top Layer: 3.8,50.76 9.19,50.76 9.19,49.06 3.8,49.06
VBUS on Bottom Layer: 7.92,46.68 9.13,46.68 9.13,45.46 7.92,45.46
VCC-3.3V on Top Layer: 16.55,49.93 17.57,49.93 17.57,48.72 16.55,48.72
VCC-5V on Top Layer: 11.01,29.97 19.3,29.97 19.3,23.47 11.01,23.47
VCC-5V on Bottom Layer: 20.26,16.91 21.78,16.91 21.78,15.39 20.26,15.39
VIN on Top Layer: 56.94,32.87 58.82,32.87 58.82,32.1 56.94,32.1
VIN on Top Layer: 10.76,18.74 17.29,18.74 17.29,16.38 10.76,16.38
VIN on Top Layer: 2.05,20.52 9.29,20.52 9.29,17.17 2.05,17.17
VIN on Top Layer: 5.43,22.4 11.32,22.4 11.32,17.68 5.43,17.68
VIN on Top Layer: 58.57,33.37 58.72,33.22 58.72,32.92 57.98,32.18 57.17,32.18 56.26,33.09 56.26,33.27 56.36,33.37
VIN on Bottom Layer: 1.31,26.36 6.14,26.36 6.14,25.75 1.31,25.75
VIN on Bottom Layer: 1.97,20.27 2.79,20.27 2.79,18.44 1.97,18.44
B- on Top Layer: 42.66,19.2 46.73,19.2 46.73,16.28 42.66,16.28
SCL_1 on Bottom Layer: 25.34,16.91 26.86,16.91 26.86,15.39 25.34,15.39
SDA_1 on Bottom Layer: 27.88,16.91 29.4,16.91 29.4,15.39 27.88,15.39
$1N18226 on Top Layer: 5.78,28.9 12.08,28.9 12.08,22.66 5.78,22.66

Small or netless copper shapes (teardrops, artwork), in the pictures only: 4 on Top Layer, 5 on Bottom Layer

## Text on the board
Bottom Silkscreen Layer: GND | VIN | DATA | BLDC | ONLY | M2 | ESP32 WROOM 32
Top Solder Mask Layer: 10/15/25
Top Silkscreen Layer: ESP32 | VCC | GND | SCL | SDA | BATTERY / ACTIVATE | SCLK | SDIN | RES | DC | CS | 5V | I34 | IO13 | IO0 | RST | EXPAND | ESP32 ROBOT EN01 | MPU-6050 | VERSION:V1.3 | EN01-SCREEN
